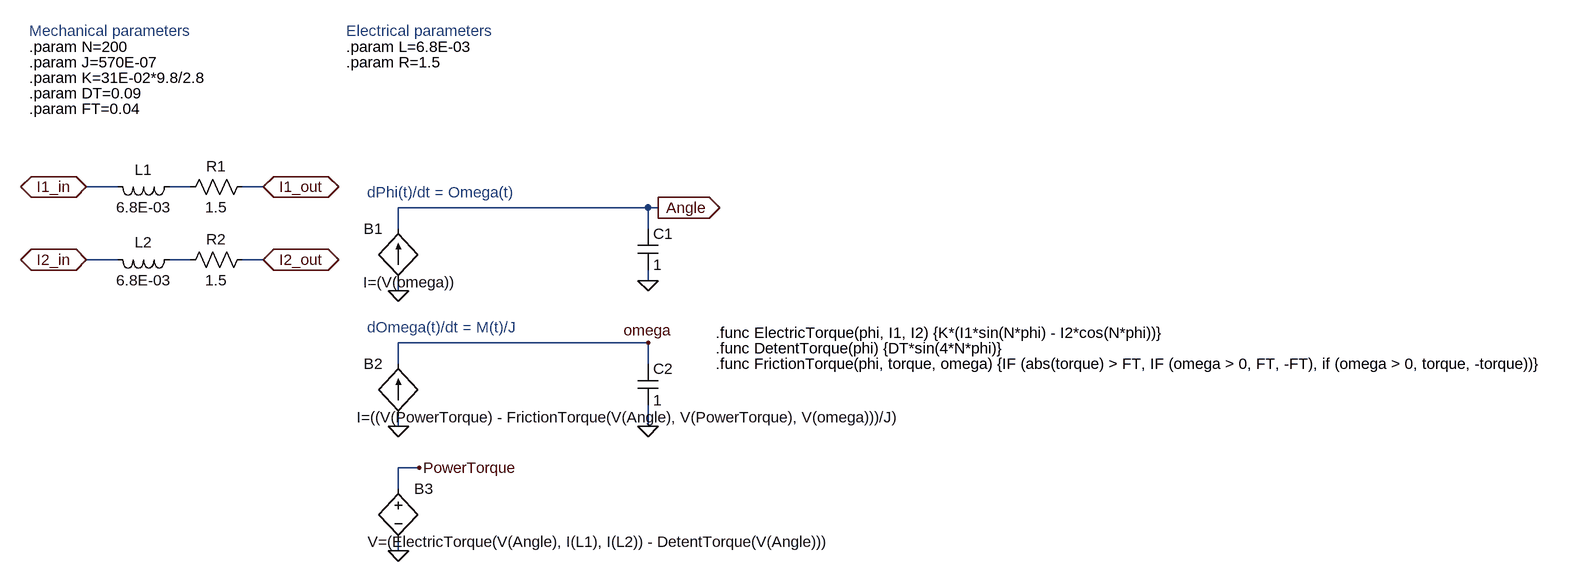
[diagram p0: schematic StepMotor.asc]
StepMotor.asc, the LTspice schematic file:
Version 4
SHEET 1 2180 680
WIRE -64 0 -112 0
WIRE 48 0 16 0
WIRE 160 0 128 0
WIRE 752 32 368 32
WIRE 768 32 752 32
WIRE 368 64 368 32
WIRE 752 64 752 32
WIRE -64 112 -112 112
WIRE 48 112 16 112
WIRE 160 112 128 112
WIRE 752 144 752 128
WIRE 368 160 368 144
WIRE 752 240 368 240
WIRE 368 272 368 240
WIRE 752 272 752 240
WIRE 368 368 368 352
WIRE 752 368 752 336
WIRE 400 432 368 432
WIRE 368 464 368 432
WIRE 368 560 368 544
FLAG -112 0 I1_in
IOPIN -112 0 BiDir
FLAG 160 0 I1_out
IOPIN 160 0 BiDir
FLAG -112 112 I2_in
IOPIN -112 112 BiDir
FLAG 160 112 I2_out
IOPIN 160 112 BiDir
FLAG 768 32 Angle
IOPIN 768 32 Out
FLAG 752 144 0
FLAG 368 160 0
FLAG 752 368 0
FLAG 368 368 0
FLAG 752 240 omega
FLAG 368 560 0
FLAG 400 432 PowerTorque
SYMBOL cap 736 64 R0
SYMATTR InstName C1
SYMATTR Value 1
SYMBOL bi 368 144 R180
WINDOW 0 24 80 Left 2
WINDOW 3 -90 -3 Left 2
SYMATTR InstName B1
SYMATTR Value I=(V(omega))
SYMBOL cap 736 272 R0
SYMATTR InstName C2
SYMATTR Value 1
SYMBOL bi 368 352 R180
WINDOW 0 24 80 Left 2
WINDOW 3 -786 -2 Left 2
SYMATTR InstName B2
SYMATTR Value I=((V(PowerTorque) - FrictionTorque(V(Angle), V(PowerTorque), V(omega)))/J)
SYMBOL ind 32 -16 R90
WINDOW 0 5 56 VBottom 2
WINDOW 3 32 56 VTop 2
SYMATTR InstName L1
SYMATTR Value 6.8E-03
SYMBOL res 144 -16 R90
WINDOW 0 0 56 VBottom 2
WINDOW 3 32 56 VTop 2
SYMATTR InstName R1
SYMATTR Value 1.5
SYMBOL ind 32 96 R90
WINDOW 0 5 56 VBottom 2
WINDOW 3 32 56 VTop 2
SYMATTR InstName L2
SYMATTR Value 6.8E-03
SYMBOL res 144 96 R90
WINDOW 0 0 56 VBottom 2
WINDOW 3 32 56 VTop 2
SYMATTR InstName R2
SYMATTR Value 1.5
SYMBOL bv 368 448 R0
WINDOW 3 -47 98 Left 2
SYMATTR Value V=(ElectricTorque(V(Angle), I(L1), I(L2)) - DetentTorque(V(Angle)))
SYMATTR InstName B3
TEXT -200 -216 Left 2 !.param N=200
TEXT -200 -192 Left 2 !.param J=570E-07
TEXT -200 -168 Left 2 !.param K=31E-02*9.8/2.8
TEXT -200 -144 Left 2 !.param DT=0.09
TEXT -200 -120 Left 2 !.param FT=0.04
TEXT -200 -240 Left 2 ;Mechanical parameters
TEXT 288 -240 Left 2 ;Electrical parameters
TEXT 288 -216 Left 2 !.param L=6.8E-03
TEXT 288 -192 Left 2 !.param R=1.5
TEXT 320 8 Left 2 ;dPhi(t)/dt = Omega(t)
TEXT 320 216 Left 2 ;dOmega(t)/dt = M(t)/J
TEXT 856 224 Left 2 !.func ElectricTorque(phi, I1, I2) {K*(I1*sin(N*phi) - I2*cos(N*phi))}
TEXT 856 248 Left 2 !.func DetentTorque(phi) {DT*sin(4*N*phi)}
TEXT 856 272 Left 2 !.func FrictionTorque(phi, torque, omega) {IF (abs(torque) > FT, IF (omega > 0, FT, -FT), if (omega > 0, torque, -torque))}

The netlist it stands for:
* StepMotor.asc
C1 Angle 0 1
B1 0 Angle I=(V(omega))
C2 omega 0 1
B2 0 omega I=((V(PowerTorque) - FrictionTorque(V(Angle), V(PowerTorque), V(omega)))/J)
L1 N001 I1_in 6.8E-03
R1 I1_out N001 1.5
L2 N002 I2_in 6.8E-03
R2 I2_out N002 1.5
B3 PowerTorque 0 V=(ElectricTorque(V(Angle), I(L1), I(L2)) - DetentTorque(V(Angle)))
.param N=200
.param J=570E-07
.param K=31E-02*9.8/2.8
.param DT=0.09
.param FT=0.04
* Mechanical parameters
* Electrical parameters
.param L=6.8E-03
.param R=1.5
* dPhi(t)/dt = Omega(t)
* dOmega(t)/dt = M(t)/J
.func ElectricTorque(phi, I1, I2) {K*(I1*sin(N*phi) - I2*cos(N*phi))}
.func DetentTorque(phi) {DT*sin(4*N*phi)}
.func FrictionTorque(phi, torque, omega) {IF (abs(torque) > FT, IF (omega > 0, FT, -FT), if (omega > 0, torque, -torque))}
.backanno
.end